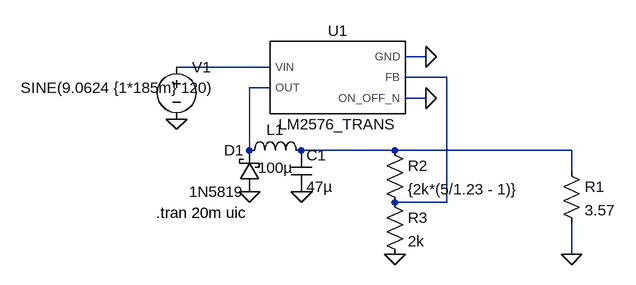
[diagram p0: schematic Buck5v.asc]
Buck5v.asc, the LTspice schematic file:
Version 4
SHEET 1 880 680
WIRE 320 128 288 128
WIRE 80 144 -64 144
WIRE 352 160 288 160
WIRE 80 176 48 176
WIRE 320 192 288 192
WIRE 48 272 48 176
WIRE 272 272 128 272
WIRE 544 272 272 272
WIRE 544 304 544 272
WIRE 352 352 352 160
WIRE 352 352 272 352
WIRE 544 432 544 384
FLAG 320 128 0
FLAG 320 192 0
FLAG -64 224 0
FLAG 48 336 0
FLAG 128 336 0
FLAG 272 432 0
FLAG 544 432 0
SYMBOL LM2576_TRANS 176 160 R0
SYMATTR InstName U1
SYMBOL voltage -64 128 R0
WINDOW 123 0 0 Left 0
WINDOW 39 0 0 Left 0
WINDOW 3 -240 48 Left 2
SYMATTR Value SINE(9.0624 {1*185m} 120)
SYMATTR InstName V1
SYMBOL ind 32 288 R270
WINDOW 0 32 56 VTop 2
WINDOW 3 5 56 VBottom 2
SYMATTR InstName L1
SYMATTR Value 100µ
SYMBOL cap 112 272 R0
SYMATTR InstName C1
SYMATTR Value 47µ
SYMBOL res 528 288 R0
SYMATTR InstName R1
SYMATTR Value 3.57
SYMBOL schottky 64 336 R180
WINDOW 0 24 64 Left 2
WINDOW 3 24 0 Left 2
SYMATTR InstName D1
SYMATTR Value 1N5819
SYMATTR Description Diode
SYMATTR Type diode
SYMBOL res 256 256 R0
SYMATTR InstName R2
SYMATTR Value {2k*(5/1.23 - 1)}
SYMBOL res 256 336 R0
SYMATTR InstName R3
SYMATTR Value 2k
TEXT -96 368 Left 2 !.tran 20m uic

The netlist it stands for:
* Buck5v.asc
XU1 N001 N003 0 N002 0 LM2576_TRANS  ; pins VIN OUT GND FB ON_OFF_N
V1 N001 0 SINE(9.0624 {1*185m} 120)
L1 N003 N004 100µ
C1 N004 0 47µ
R1 N004 0 3.57
D1 0 N003 1N5819
R2 N004 N002 {2k*(5/1.23 - 1)}
R3 N002 0 2k
.model D D
.lib standard.dio
.tran 20m uic
.lib C:\users\omar\My Documents\University\IX_Semester\Disenio\Easyrun\Circuit Design\LTspice Simulations\LM2576_TRANS.LIB
.backanno
.end